# EAGLE design finalboard (EAGLE 7.1.0)
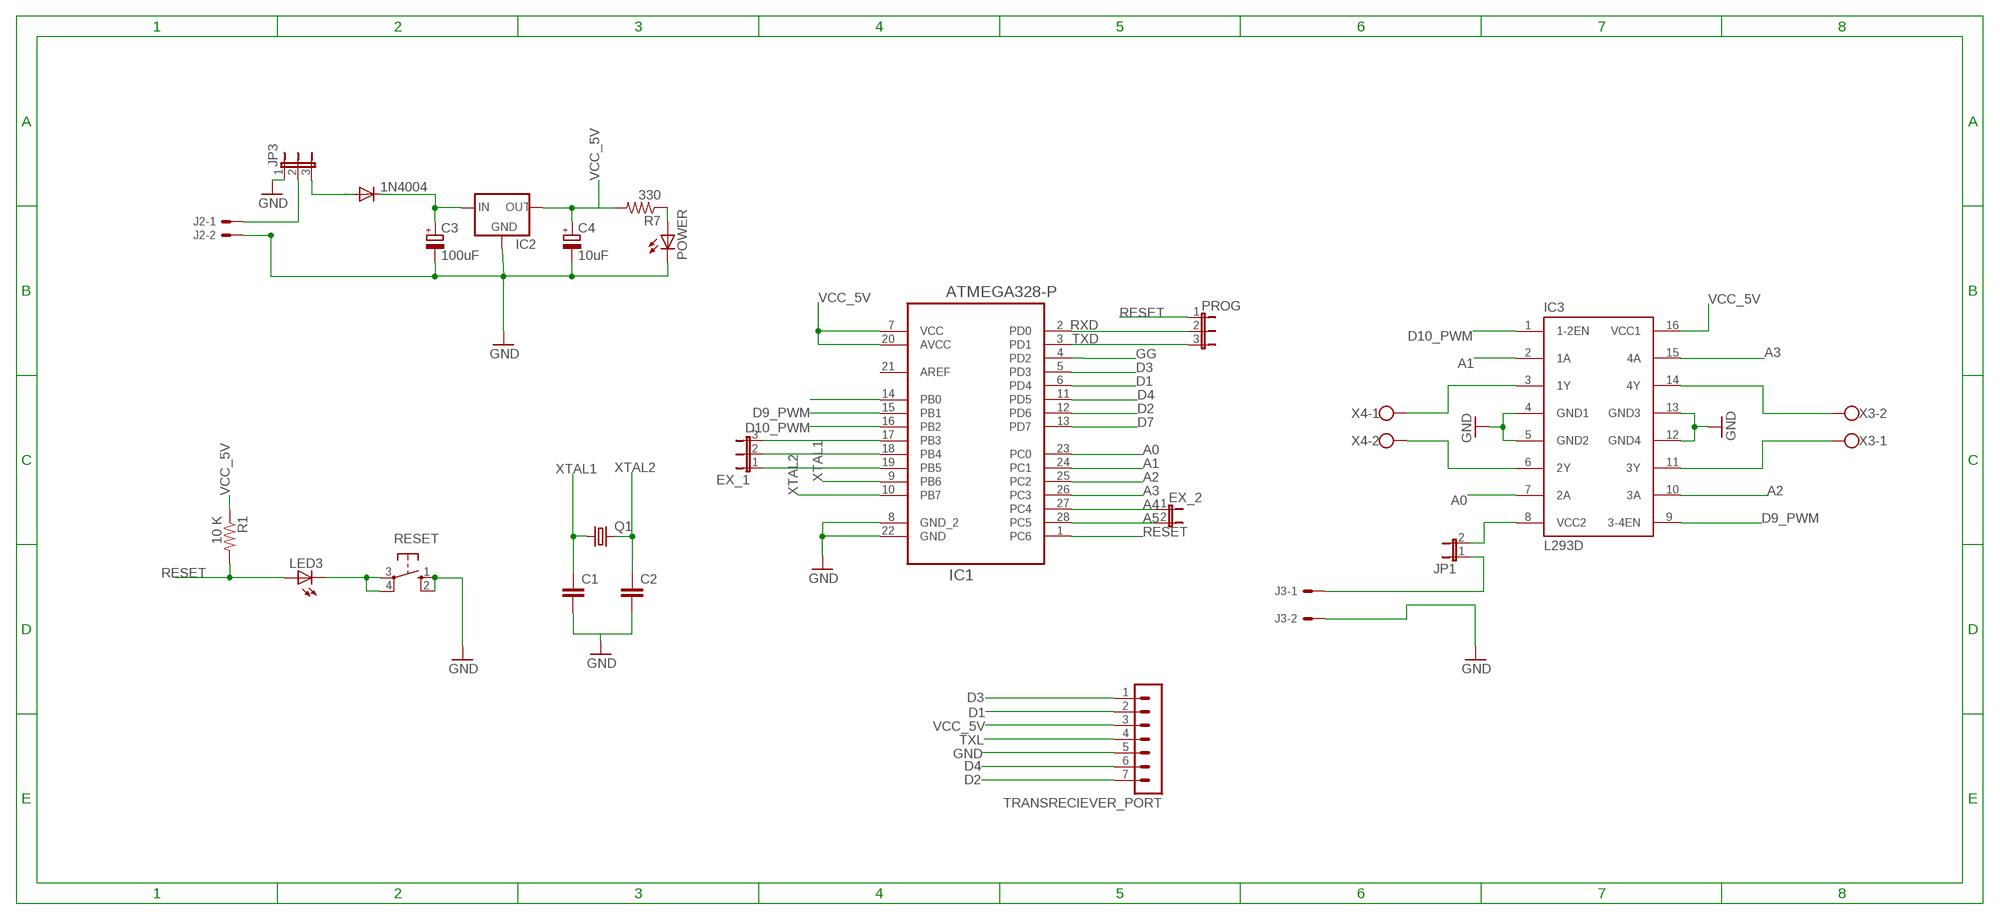
[diagram p0: schematic, sheet 1]

## Parts
1N4004  1N4004  [DO41-10]
ATMEGA328-P  IC1  ATMEGA328P-PU  [DIP254P762X457-28]
C1  C-EU025-025X050  [C025-025X050]
C2  C-EU025-025X050  [C025-025X050]
C3  100uF  CPOL-EUE2,5-6E  [E2,5-6E]
C4  10uF  CPOL-EUE2-5  [E2-5]
EX_1  JP2E  [JP2]
EX_2  JP1E  [JP1]
IC2  78XXL  [78XXL]
IC3  L293D  [DIL16]
J2  22-05-7028-02  [7395-02]
J3  22-05-7028-02  [7395-02]
JP1  JP1E  [JP1]
JP3  JP2E  [JP2]
LED3  LED3MM  [LED3MM]
POWER  LED3MM  [LED3MM]
PROG  JP2E  [JP2]
Q1  CRYSTALHC49U70  [HC49U70]
R1  10 K  R-US_0207/12  [0207/12]
R7  330  R-US_0204/7  [0204/7]
RESET  10-XX  [B3F-10XX]
TRANSRECIEVER_PORT  MA07-1  [MA07-1]
X3  W237-102  [W237-102]
X4  W237-102  [W237-102]

## Nets
A0: ATMEGA328-P.23(PC0) IC3.7(2A)
A1: ATMEGA328-P.24(PC1) IC3.2(1A)
A2: ATMEGA328-P.25(PC2) IC3.10(3A)
A3: ATMEGA328-P.26(PC3) IC3.15(4A)
A4: ATMEGA328-P.27(PC4) EX_2.1
A5: ATMEGA328-P.28(PC5) EX_2.2
D1: ATMEGA328-P.6(PD4) TRANSRECIEVER_PORT.2
D2: ATMEGA328-P.12(PD6) TRANSRECIEVER_PORT.7
D3: ATMEGA328-P.5(PD3) TRANSRECIEVER_PORT.1
D4: ATMEGA328-P.11(PD5) TRANSRECIEVER_PORT.6
D7: ATMEGA328-P.13(PD7)
D9_PWM: ATMEGA328-P.15(PB1) IC3.9(3-4EN)
D10_PWM: ATMEGA328-P.16(PB2) IC3.1(1-2EN)
GG: ATMEGA328-P.4(PD2)
GND: ATMEGA328-P.8(GND_2) ATMEGA328-P.22(GND) C1.2 C2.2 C3.- C4.- IC2.GND IC3.4(GND1) IC3.5(GND2) IC3.12(GND4) IC3.13(GND3) J2.2 J3.2 JP3.1 POWER.K(C) RESET.1(S) RESET.2(S1) TRANSRECIEVER_PORT.5
N$1: LED3.K(C) RESET.3(P) RESET.4(P1)
N$2: ATMEGA328-P.17(PB3) EX_1.3
N$3: ATMEGA328-P.18(PB4) EX_1.2
N$4: ATMEGA328-P.19(PB5) EX_1.1
N$5: J3.1 JP1.1
N$6: IC3.8(VCC2) JP1.2
N$11: POWER.A R7.1
N$13: J2.1 JP3.2
N$23: 1N4004.A JP3.3
N$28: IC3.14(4Y) X3.2
N$29: IC3.11(3Y) X3.1
N$30: IC3.6(2Y) X4.2
NAK1: IC3.3(1Y) X4.1
RESET: ATMEGA328-P.1(PC6) LED3.A PROG.1 R1.2
RXD: ATMEGA328-P.2(PD0) PROG.2
TXD: ATMEGA328-P.3(PD1) PROG.3
TXL: ATMEGA328-P.14(PB0) TRANSRECIEVER_PORT.4
VCC_5V: ATMEGA328-P.7(VCC) ATMEGA328-P.20(AVCC) C4.+ IC2.OUT IC3.16(VCC1) R1.1 R7.2 TRANSRECIEVER_PORT.3
VCC_9V: 1N4004.C C3.+ IC2.IN
XTAL1: ATMEGA328-P.9(PB6) C1.1 Q1.1
XTAL2: ATMEGA328-P.10(PB7) C2.1 Q1.2
Unconnected: ATMEGA328-P.21(AREF)

## Library data of the parts
1N4004 = diode:1N4004: DIODE general purpose rectifier, 1 A
ATMEGA328-P = Atmel_By_element14_Batch_1-00:ATMEGA328P-PU: 8-bit Microcontroller with In-System Programmable Flash; MPN: ATMEGA328P-PU; OC_FARNELL: 1715487; OC_NEWARK: 15R0268; PACKAGE: PDIP-28; SUPPLIER: Atmel
C1 C2 = rcl:C-EU: CAPACITOR, European symbol
C3 C4 = rcl:CPOL-EU: POLARIZED CAPACITOR, European symbol
EX_1 JP3 PROG = jumper:JP2E: JUMPER
EX_2 JP1 = jumper:JP1E: JUMPER
IC2 = v-reg:78XXL: VOLTAGE REGULATOR
IC3 = st-microelectronics:L293D: PUSH-PULL 4 CHANNEL DRIVER; MPN: L293D; OC_FARNELL: 9589619; OC_NEWARK: 56P8249
J2 J3 = con-molex:22-?-02: CONNECTOR wire to board 2.54 mm (.1 inch) pitch header; OC_FARNELL: 9731601; OC_NEWARK: unknown
LED3 POWER = led:LED: LED OSRAM: - CHIPLED LG R971, LG N971, LY N971, LG Q971, LY Q971, LO R971, LY R971 LH N974, LH R974 LS Q976, LO Q976, LY Q976 LO Q996 - Hyper CHIPLED LW Q18S LB Q993, LB Q99A, LB R99A - SideLED LS A670, LO A670, LY A670, LG A670, LP A670 LB A673, LV A673, LT A673, LW A673 LH A674 LY A675 LS A676, LA A676, LO A676, LY A676, LW A676 LS A679, LY A679, LG A679 - Hyper Micro SIDELED® LS Y876, LA Y876, LO Y876, LY Y876 LT Y87S - SmartLED LW L88C, LW L88S LB L89C, LB L89S, LG L890 LS L89K, LO L89K, LY L89K LS L896, LA L896, LO L896, LY L896 - TOPLED LS T670, LO T670, LY T670, LG T670, LP T670 LSG T670, LSP T670, LSY T670, LOP T670, LYG T670 LG T671, LOG T671, LSG T671 LB T673, LV T673, LT T673, LW T673 LH T674 LS T676, LA T676, LO T676, LY T676, LB T676, LH T676, LSB T676, LW T676 LB T67C, LV T67C, LT T67C, LS T67K, LO T67K, LY T67K, LW E67C LS E67B, LA E67B, LO E67B, LY E67B, LB E67C, LV E67C, LT E67C LW T67C LS T679, LY T679, LG T679 LS T770, LO T770, LY T770, LG T770, LP T770 LB T773, LV T773, LT T773, LW T773 LH T774 LS E675, LA E675, LY E675, LS T675 LS T776, LA T776, LO T776, LY T776, LB T776 LHGB T686 LT T68C, LB T68C - Hyper Mini TOPLED® LB M676 - Mini TOPLED Santana® LG M470 LS M47K, LO M47K, LY M47K Source: http://www.osram.convergy.de LUXEON: - LUMILED® LXK2-PW12-R00, LXK2-PW12-S00, LXK2-PW14-U00, LXK2-PW14-V00 LXK2-PM12-R00, LXK2-PM12-S00, LXK2-PM14-U00 LXK2-PE12-Q00, LXK2-PE12-R00, LXK2-PE12-S00, LXK2-PE14-T00, LXK2-PE14-U00 LXK2-PB12-K00, LXK2-PB12-L00, LXK2-PB12-M00, LXK2-PB14-N00, LXK2-PB14-P00, LXK2-PB14-Q00 LXK2-PR12-L00, LXK2-PR12-M00, LXK2-PR14-Q00, LXK2-PR14-R00 LXK2-PD12-Q00, LXK2-PD12-R00, LXK2-PD12-S00 LXK2-PH12-R00, LXK2-PH12-S00 LXK2-PL12-P00, LXK2-PL12-Q00, LXK2-PL12-R00 Source: www.luxeon.com KINGBRIGHT: KA-3528ASYC Source: www.kingbright.com
Q1 = crystal:CRYSTAL: CRYSTAL; OC_FARNELL: unknown; OC_NEWARK: unknown
R1 R7 = resistor:R-US_: RESISTOR, American symbol
RESET = switch-omron:10-XX: OMRON SWITCH; MPN: B3F-1000; OC_FARNELL: 176432; OC_NEWARK: 36M3542
TRANSRECIEVER_PORT = con-lstb:MA07-1: PIN HEADER; OC_FARNELL: unknown; OC_NEWARK: unknown
X3 X4 = con-wago-500:W237-102: WAGO SCREW CLAMP; MPN: 237-102; OC_FARNELL: unknown; OC_NEWARK: 70K9898

## Board
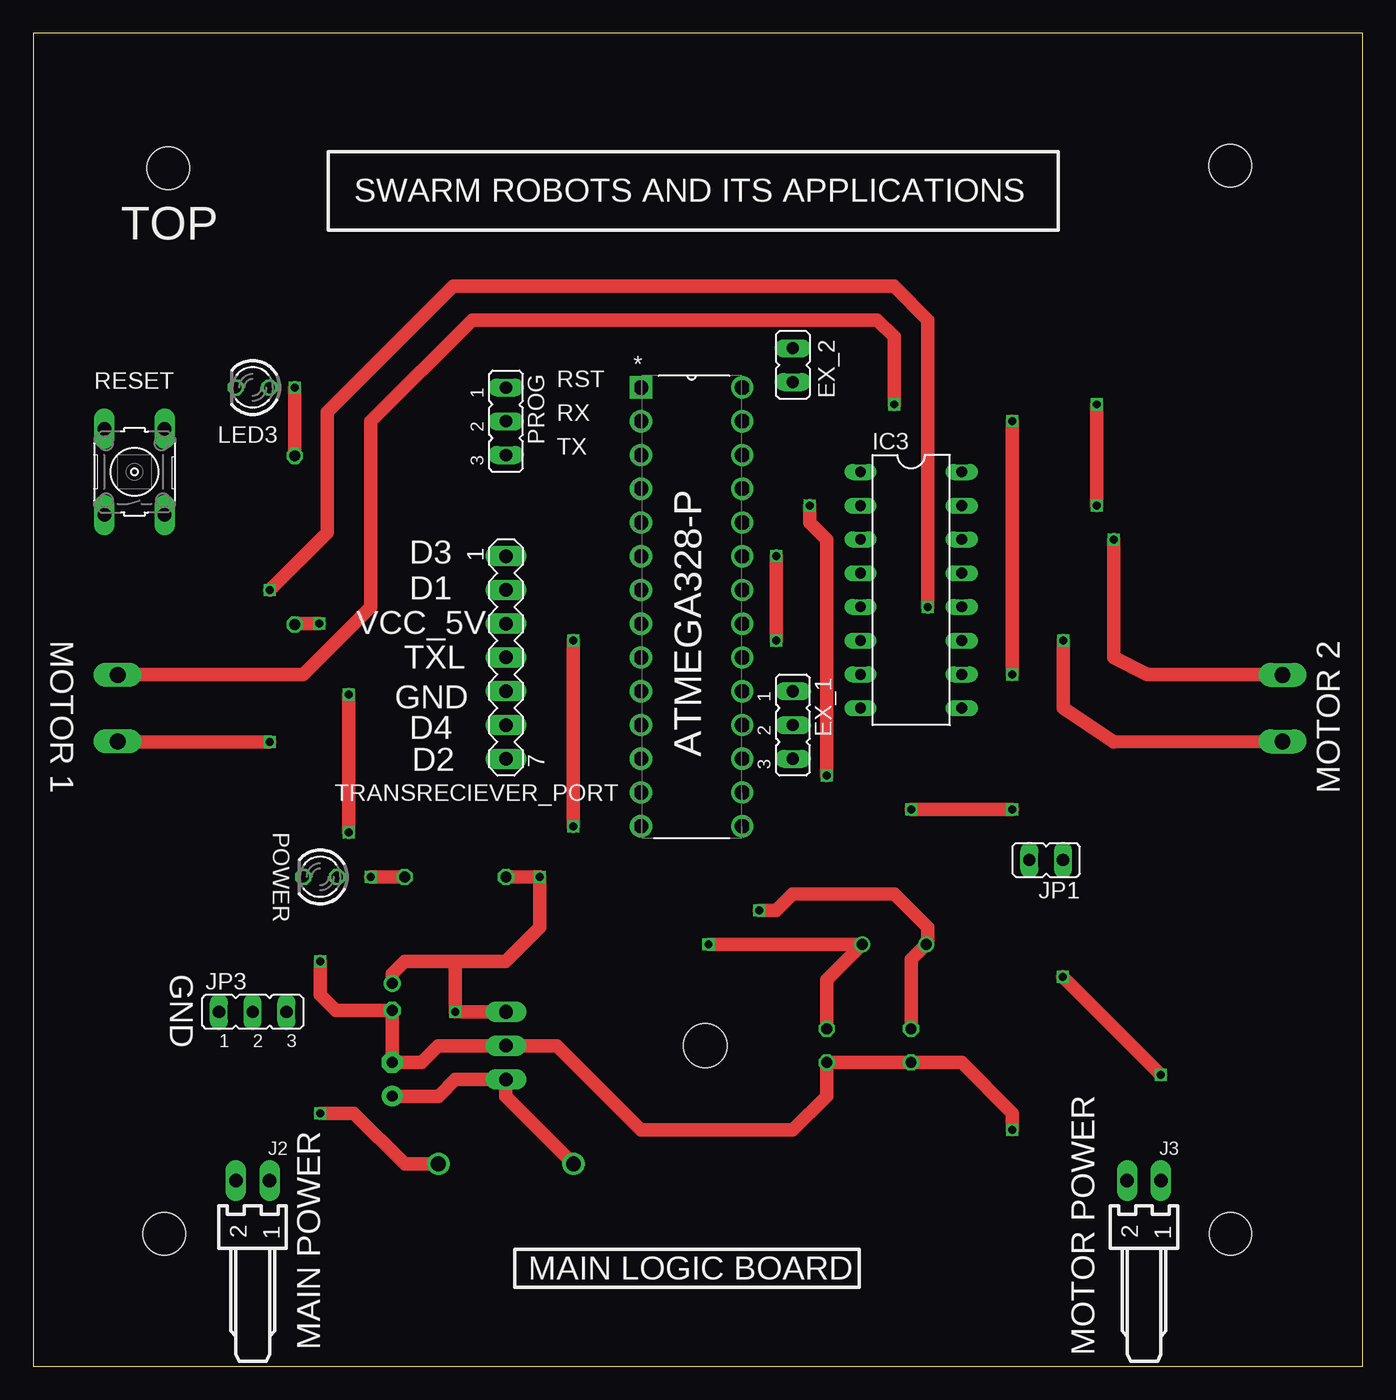
[diagram p1: board, top side]
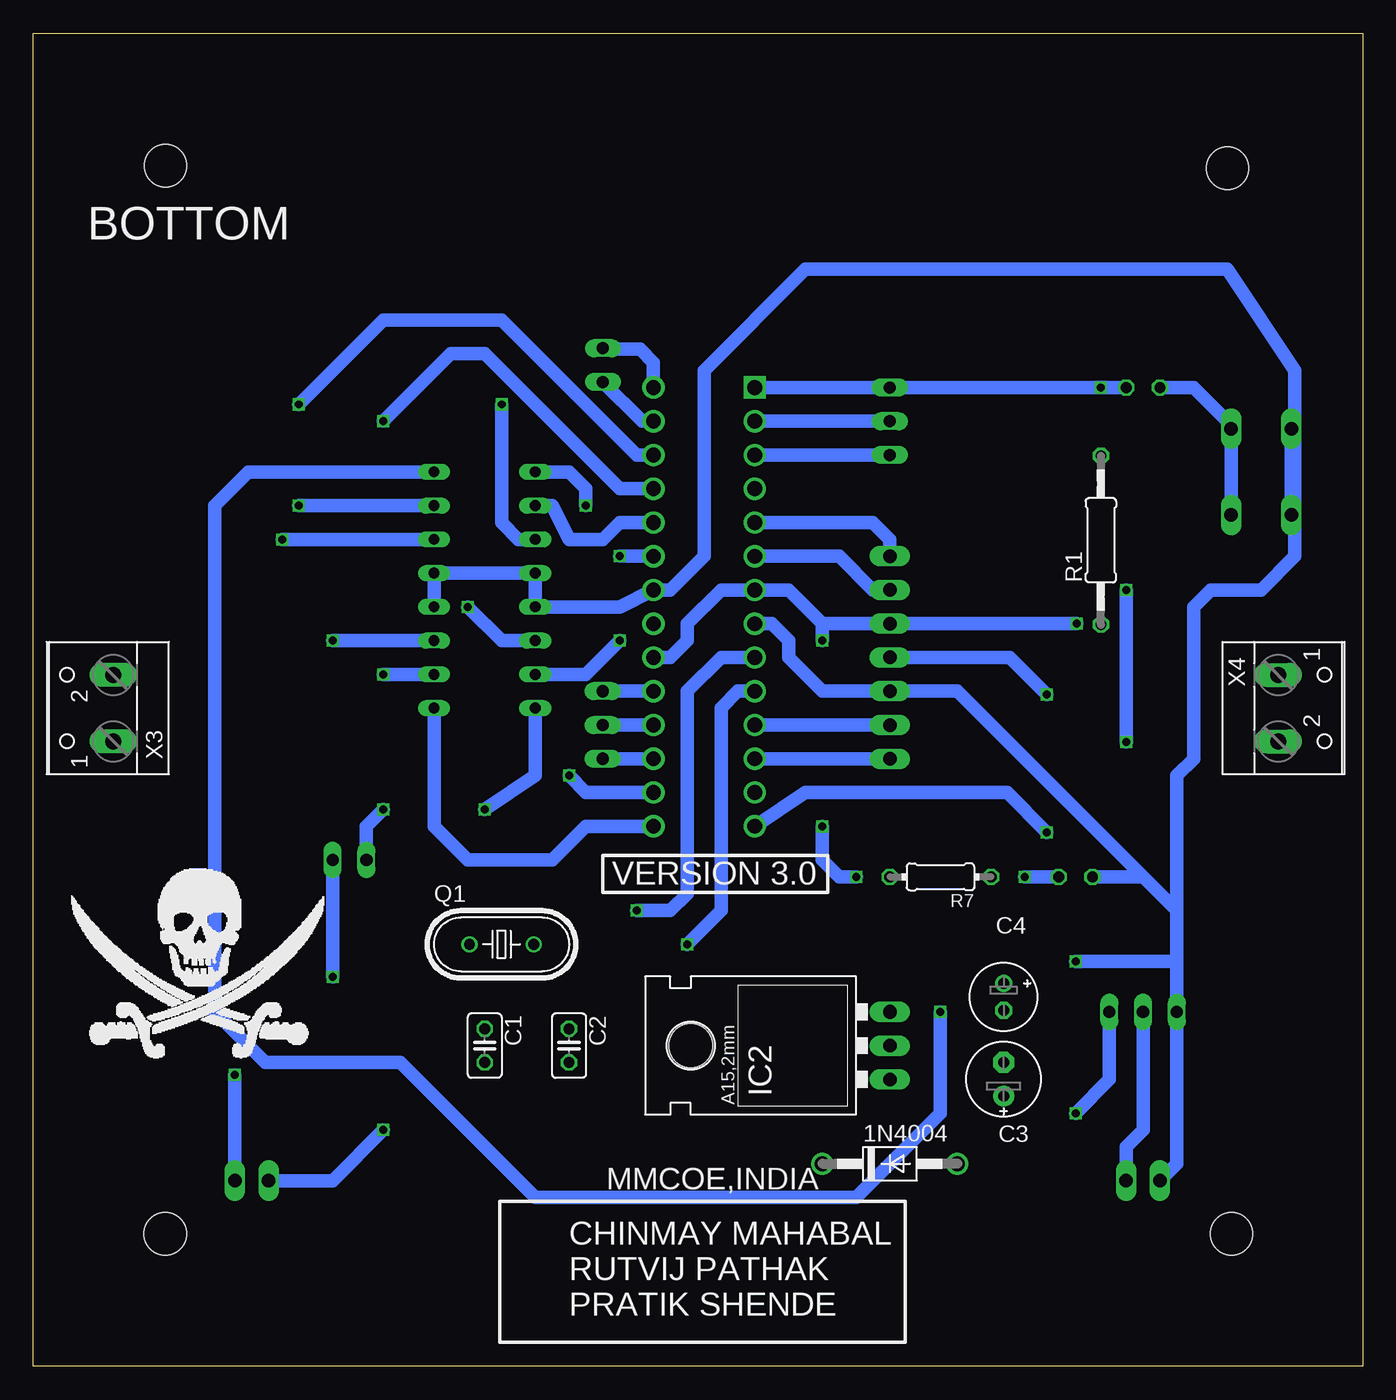
[diagram p2: board, bottom side, seen from below]

Size 100 x 100.32 mm. Coordinates in mm from the lower left corner, seen from the top.
Outline: 0,0 100,0 100,100.32 0,100.32 0,0
Copper layers (1*16): Top 0.035mm / dielectric 1.6mm / Bottom 0.035mm
Design rules "Elecrow_2-layer_PCB_eagle_rule": minimum track width 6mil, minimum drill 12mil, track to track 6mil, track to pad 6mil, pad to pad 6mil, via to via 8mil, smd to smd 0mil, copper to edge 20mil, drill to drill 10mil, minimum pad ring 6mil, minimum via ring 6mil, stop-mask expansion 0mil, vias tented up to drill 100mil, thermal gap 10mil
Holes 3.2 mm at 10.16,90.17 90.05,90.35 9.86,9.96 90.07,9.96

### Footprints (pad centres in the part's own frame; a part is rotated, then mirrored left to right if it is on the bottom)
DO41-10 = drill 1.118: A 5.08,0; C -5.08,0
DIP254P762X457-28 = drill 1.118 square: 1 -7.62,33.02 | drill 1.118: 2 -7.62,30.48; 3 -7.62,27.94; 4 -7.62,25.4; 5 -7.62,22.86; 6 -7.62,20.32; 7 -7.62,17.78; 8 -7.62,15.24; 9 -7.62,12.7; 10 -7.62,10.16; 11 -7.62,7.62; 12 -7.62,5.08; 13 -7.62,2.54; 14 -7.62,0; 15 0,0; 16 0,2.54; 17 0,5.08; 18 0,7.62; 19 0,10.16; 20 0,12.7; 21 0,15.24; 22 0,17.78; 23 0,20.32; 24 0,22.86; 25 0,25.4; 26 0,27.94; 27 0,30.48; 28 0,33.02
C025-025X050 = drill 0.813 octagon: 1 -1.27,0; 2 1.27,0
E2,5-6E = drill 0.813 pad 1.575: + -1.27,0 | drill 0.813 pad 1.575 octagon: - 1.27,0
E2-5 = drill 0.813 pad 1.27: + -1.016,0 | drill 0.813 pad 1.27 octagon: - 1.016,0
JP2 = drill 0.914 long: 1 -2.54,0; 2 0,0; 3 2.54,0
JP1 = drill 0.914 long: 1 0,-1.27; 2 0,1.27
78XXL = drill 1.016 long: GND 0,-3.81; IN -2.54,-3.81; OUT 2.54,-3.81 | hole 3.302: 0,11.176
DIL16 = drill 0.813 long: 1 -8.89,-3.81; 2 -6.35,-3.81; 3 -3.81,-3.81; 4 -1.27,-3.81; 5 1.27,-3.81; 6 3.81,-3.81; 7 6.35,-3.81; 8 8.89,-3.81; 9 8.89,3.81; 10 6.35,3.81; 11 3.81,3.81; 12 1.27,3.81; 13 -1.27,3.81; 14 -3.81,3.81; 15 -6.35,3.81; 16 -8.89,3.81
7395-02 = drill 1.016 long: 1 1.27,0; 2 -1.27,0
LED3MM = drill 0.813 octagon: A -1.27,0; K 1.27,0
HC49U70 = drill 0.813: 1 -2.413,0; 2 2.413,0
0207/12 = drill 0.813 octagon: 1 -6.35,0; 2 6.35,0
0204/7 = drill 0.813 octagon: 1 -3.81,0; 2 3.81,0
B3F-10XX = drill 1.016 long: 1 -3.251,2.261; 2 3.251,2.261; 3 -3.251,-2.261; 4 3.251,-2.261
MA07-1 = drill 1.016 long: 1 -7.62,0; 2 -5.08,0; 3 -2.54,0; 4 0,0; 5 2.54,0; 6 5.08,0; 7 7.62,0
W237-102 = drill 1.194 long: 1 -2.5,-1.27; 2 2.5,-1.27

### Placement (x,y rotation side)
1N4004  35.56,15.24 0 bottom
ATMEGA328-P  53.34,40.64 0 top
C1  66.04,24.13 270 bottom
C2  59.69,24.13 270 bottom
C3  27,21.6 90 bottom
C4  27,27.8 270 bottom
EX_1  57.15,48.26 270 top
EX_2  57.14,75.35 0 top
IC2  39.37,24.13 90 bottom
IC3  66.04,58.42 270 top
J2  16.51,13.97 0 top
J3  83.57,13.97 0 top
JP1  76.2,38.1 90 top
JP3  16.51,26.67 0 top
LED3  16.51,73.66 180 top
POWER  21.59,36.83 180 top
PROG  35.56,71.12 270 top
Q1  64.77,31.75 0 bottom
R1  19.68,62.17 90 bottom
R7  31.75,36.83 180 bottom
RESET  7.62,67.31 90 top
TRANSRECIEVER_PORT  35.56,53.34 270 top
X3  95.25,49.53 90 bottom
X4  5.08,49.53 270 bottom

### Tracks (layer width: path | path; a pad name or v marks a point on that pad's centre or on a via)
A0  (via drill 0.6)
  Top 1.016: v55.88,60.96 v55.88,54.61
  Bottom 1.016: ATMEGA328-P.23 v55.88,60.96 | v55.88,54.61 58.42,52.07 IC3.7
A1
  Bottom 1.016: IC3.2 60.96,64.77 59.69,62.23 57.15,62.23 55.88,63.5 ATMEGA328-P.24
A2  (via drill 0.6)
  Top 1.016: v73.66,71.12 v73.66,52.07
  Bottom 1.016: v73.66,71.12 68.58,76.2 66.04,76.2 55.88,66.04 ATMEGA328-P.25 | v73.66,52.07 IC3.10
A3  (via drill 0.6)
  Top 1.016: v80.01,72.39 v80.01,64.77
  Bottom 1.016: v80.01,64.77 IC3.15 | v80.01,72.39 73.66,78.74 64.77,78.74 54.61,68.58 ATMEGA328-P.26
A4
  Bottom 1.016: ATMEGA328-P.27 54.19,71.12 EX_2.1
A5
  Bottom 1.016: ATMEGA328-P.28 53.34,75.52 54.35,76.53 57.06,76.53 EX_2.2
D1
  Bottom 1.016: ATMEGA328-P.6 39.37,60.96 36.83,58.42 TRANSRECIEVER_PORT.2
D2
  Bottom 1.016: ATMEGA328-P.12 TRANSRECIEVER_PORT.7
D3
  Bottom 1.016: ATMEGA328-P.5 36.83,63.5 35.56,62.23 TRANSRECIEVER_PORT.1
D4
  Bottom 1.016: ATMEGA328-P.11 TRANSRECIEVER_PORT.6
D9_PWM
  Bottom 1.016: ATMEGA328-P.15 58.42,40.64 60.96,38.1 67.31,38.1 69.85,40.64 IC3.9
D10_PWM  (via drill 0.6)
  Top 1.016: v58.42,64.77 58.42,63.5 59.69,62.23 v59.69,44.45
  Bottom 1.016: ATMEGA328-P.16 58.42,43.18 v59.69,44.45 | IC3.1 59.69,67.31 58.42,66.04 v58.42,64.77
GND  (via drill 0.6)
  Top 1.016: v73.66,17.78 73.66,19.05 69.85,22.86 C1.2 C2.2 59.69,20.32 57.15,17.78 45.72,17.78 39.37,24.13 IC2.GND 30.48,24.13 29.22,22.87 C3.- C4.- 22.75,26.78 21.59,27.94 v21.59,30.48
  Bottom 1.016: IC3.12 IC3.13 IC3.4 IC3.5 55.88,57.15 ATMEGA328-P.22 52.07,58.42 49.53,60.96 49.53,74.93 41.91,82.55 10.16,82.55 5.08,74.93 5.08,70.84 | ATMEGA328-P.8 44.45,55.88 43.18,54.61 43.18,53.34 40.64,50.8 TRANSRECIEVER_PORT.5 30.48,50.8 16.51,36.83 | 5.08,70.84 RESET.2 RESET.1 | 5.08,70.84 5.08,60.96 7.62,58.42 11.43,58.42 12.7,57.15 12.7,45.72 13.97,44.45 13.97,34.29 | 13.97,30.48 JP3.1 13.97,15.24 J2.2 | v21.59,30.48 13.97,30.48 | 13.97,30.48 13.97,34.29 | POWER.K 16.51,36.83 | 16.51,36.83 13.97,34.29 | J3.2 77.47,13.97 v73.66,17.78
N$1
  Bottom 1.016: LED3.K 12.7,73.66 9.88,70.84 RESET.4 RESET.3
N$2
  Bottom 1.016: ATMEGA328-P.17 EX_1.3
N$3
  Bottom 1.016: ATMEGA328-P.18 EX_1.2
N$4
  Bottom 1.016: ATMEGA328-P.19 EX_1.1
N$5  (via drill 0.6)
  Top 1.016: v84.83,21.92 v77.46,29.29
  Bottom 1.016: v77.46,29.29 JP1.1 | v84.83,21.92 J3.1
N$6  (via drill 0.6)
  Top 1.016: v66.04,41.91 v73.66,41.91
  Bottom 1.016: IC3.8 62.23,44.45 v66.04,41.91 | v73.66,41.91 74.93,40.64 JP1.2
N$11  (via drill 0.6)
  Top 1.016: R7.1 v25.4,36.83
  Bottom 1.016: v25.4,36.83 POWER.A
N$13
  Bottom 1.016: JP3.2 16.51,17.78 17.78,16.51 J2.1
N$23  (via drill 0.6)
  Top 1.016: v21.59,19.05 24.13,19.05 27.94,15.24 1N4004.A
  Bottom 1.016: JP3.3 19.05,21.59 v21.59,19.05
N$28  (via drill 0.6)
  Top 1.016: v81.28,62.23 81.28,53.34 83.82,52.07 93.94,52.07 X3.2
  Bottom 1.016: IC3.14 v81.28,62.23
N$29  (via drill 0.6)
  Top 1.016: v77.47,54.61 77.47,49.53 81.28,46.99 X3.1
  Bottom 1.016: IC3.11 v77.47,54.61
N$30  (via drill 0.6)
  Top 1.016: v67.31,57.15 67.31,78.74 64.77,81.28 31.58,81.28 22.1,71.8 22.1,62.74 v17.78,58.42 | v17.78,46.99 6.39,46.99 X4.2
  Bottom 1.016: v67.31,57.15 64.77,54.61 IC3.6 | v17.78,58.42 v17.78,46.99
NAK1  (via drill 0.6)
  Top 1.016: v64.77,72.39 64.77,77.47 63.5,78.74 33.02,78.74 25.4,71.12 25.4,57.15 20.32,52.07 6.39,52.07 X4.1
  Bottom 1.016: v64.77,72.39 64.77,63.5 63.5,62.23 IC3.3
RESET  (via drill 0.6)
  Top 1.016: R1.2 v19.68,73.66
  Bottom 1.016: ATMEGA328-P.1 PROG.1 v19.68,73.66 LED3.A
RXD
  Bottom 1.016: ATMEGA328-P.2 PROG.2
TXD
  Bottom 1.016: ATMEGA328-P.3 PROG.3
TXL  (via drill 0.6)
  Top 1.016: v23.74,50.54 v23.74,40.18
  Bottom 1.016: ATMEGA328-P.14 41.91,43.18 26.74,43.18 v23.74,40.18 | TRANSRECIEVER_PORT.4 26.54,53.34 v23.74,50.54
VCC_5V  (via drill 0.6)
  Top 1.016: v40.64,40.64 v40.64,54.61 | R7.2 v38.1,36.83 38.1,33.02 35.56,30.48 31.75,30.48 | 31.75,30.48 v31.75,26.67 IC2.OUT | v21.5,55.9 19.76,55.9 R1.1 | C4.+ 27,29.54 27.94,30.48 31.75,30.48
  Bottom 1.016: IC3.16 83.82,67.31 86.36,64.77 86.36,26.67 82.55,22.86 72.39,22.86 62.23,12.7 38.1,12.7 31.75,19.05 v31.75,26.67 | 40.64,55.88 TRANSRECIEVER_PORT.3 22.02,55.88 v21.5,55.9 | v40.64,54.61 40.64,55.88 | 40.64,55.88 43.18,58.42 ATMEGA328-P.7 48.26,58.42 50.8,55.88 50.8,54.61 52.07,53.34 ATMEGA328-P.20 | v40.64,40.64 40.64,38.1 39.37,36.83 v38.1,36.83
VCC_9V
  Top 1.016: 1N4004.C 35.56,20.32 IC2.IN 31.75,21.59 30.49,20.33 C3.+
XTAL1  (via drill 0.6)
  Top 1.016: v54.61,34.29 55.88,34.29 57.15,35.56 64.77,35.56 67.31,33.02 67.31,31.88 Q1.1 66.04,30.61 C1.1
  Bottom 1.016: ATMEGA328-P.9 48.26,53.34 50.8,50.8 50.8,35.56 52.07,34.29 v54.61,34.29
XTAL2  (via drill 0.6)
  Top 1.016: v50.8,31.75 Q1.2 59.69,29.08 C2.1
  Bottom 1.016: v50.8,31.75 48.26,34.29 48.26,49.53 46.99,50.8 ATMEGA328-P.10

### Text on the board
bPlace: MMCOE,INDIA
tNames: SWARM ROBOTS AND ITS APPLICATIONS | TOP | RST | RX | TX | D3 | D1 | MOTOR 1 | VCC_5V | MOTOR 2 | TXL | GND | D4 | D2 | GND | MAIN LOGIC BOARD | MAIN POWER | MOTOR POWER
bNames: BOTTOM | VERSION 3.0 | CHINMAY MAHABAL / RUTVIJ PATHAK / PRATIK SHENDE